# EAGLE design puissance_alim (EAGLE 6.6.0)
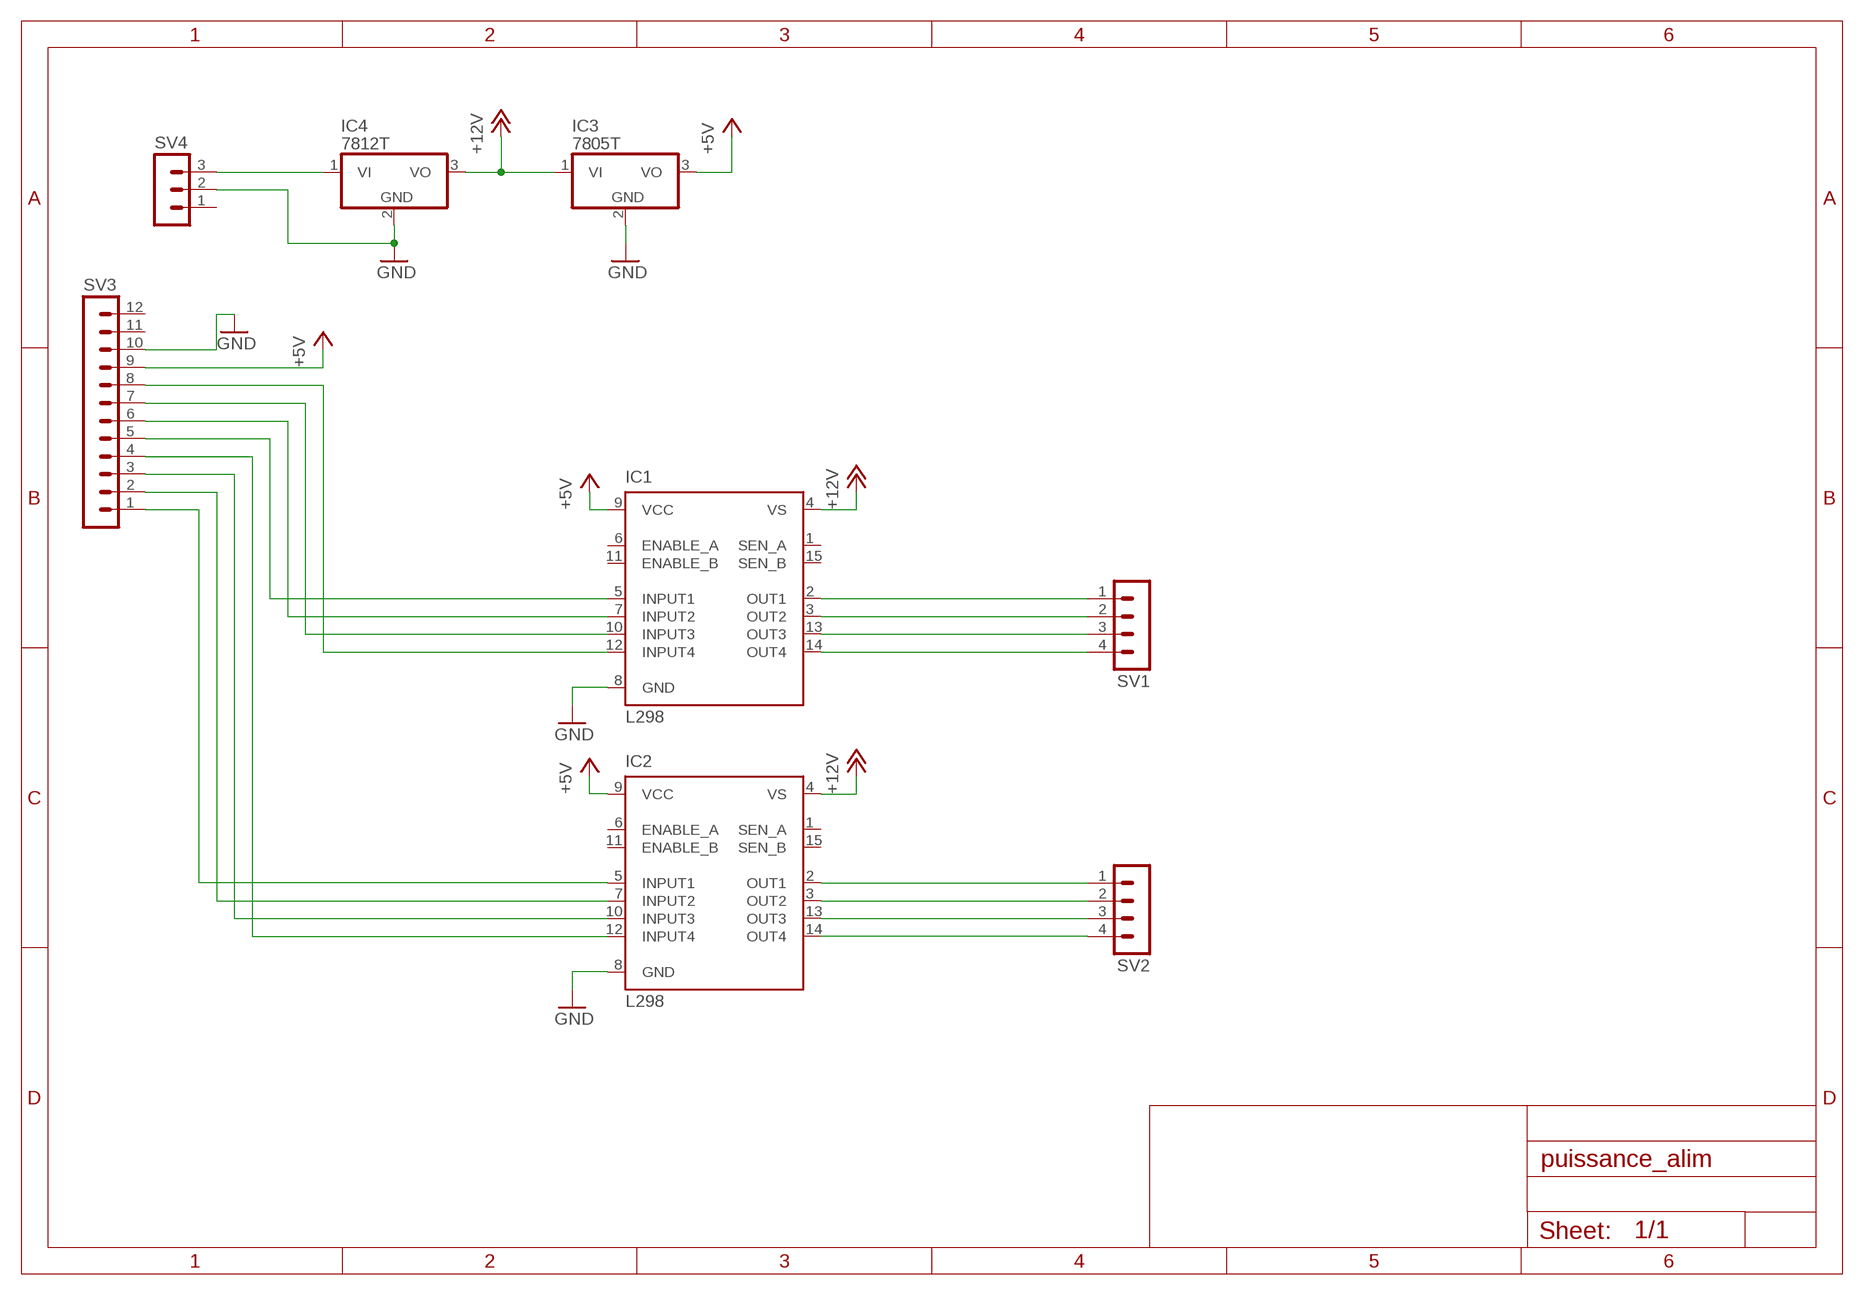
[diagram p0: schematic, sheet 1]

## Parts
IC1  L298  [MULTIWATT-15]
IC2  L298  [MULTIWATT-15]
IC3  7805T  [TO220H]
IC4  7812T  [TO220H]
SV1  MA04-1  [MA04-1]
SV2  MA04-1  [MA04-1]
SV3  MA12-1  [MA12-1]
SV4  MA03-1  [MA03-1]

## Nets
+5V: IC1.9(VCC) IC2.9(VCC) IC3.3(VO) SV3.9
+12V: IC1.4(VS) IC2.4(VS) IC3.1(VI) IC4.3(VO)
GND: IC1.8(GND) IC2.8(GND) IC3.2(GND) IC4.2(GND) SV3.10 SV4.2
N$1: IC2.5(INPUT1) SV3.1
N$2: IC2.7(INPUT2) SV3.2
N$3: IC2.10(INPUT3) SV3.3
N$4: IC2.12(INPUT4) SV3.4
N$5: IC1.5(INPUT1) SV3.5
N$6: IC1.7(INPUT2) SV3.6
N$7: IC1.10(INPUT3) SV3.7
N$8: IC1.12(INPUT4) SV3.8
N$9: IC1.2(OUT1) SV1.1
N$10: IC1.3(OUT2) SV1.2
N$11: IC1.13(OUT3) SV1.3
N$12: IC1.14(OUT4) SV1.4
N$13: IC2.2(OUT1) SV2.1
N$14: IC2.3(OUT2) SV2.2
N$15: IC2.13(OUT3) SV2.3
N$16: IC2.14(OUT4) SV2.4
N$18: IC4.1(VI) SV4.3
Unconnected: IC1.1(SEN_A) IC1.6(ENABLE_A) IC1.11(ENABLE_B) IC1.15(SEN_B) IC2.1(SEN_A) IC2.6(ENABLE_A) IC2.11(ENABLE_B) IC2.15(SEN_B) SV3.11 SV3.12 SV4.1

## Library data of the parts
IC1 IC2 = st-microelectronics:L298: DUAL FULL-BRIDGE DRIVER; MPN: L298N; OC_FARNELL: 1589425; OC_NEWARK: 32M1527
IC3 IC4 = linear:78*: Positive VOLTAGE REGULATOR Source: http://cache.national.com/ds/LM/LM78L05.pdf http://www.fairchildsemi.com/ds/LM/LM7805.pdf
SV1 SV2 = con-lstb:MA04-1: PIN HEADER; OC_FARNELL: unknown; OC_NEWARK: unknown
SV3 = con-lstb:MA12-1: PIN HEADER; OC_FARNELL: unknown; OC_NEWARK: unknown
SV4 = con-lstb:MA03-1: PIN HEADER; OC_FARNELL: unknown; OC_NEWARK: unknown

## Board
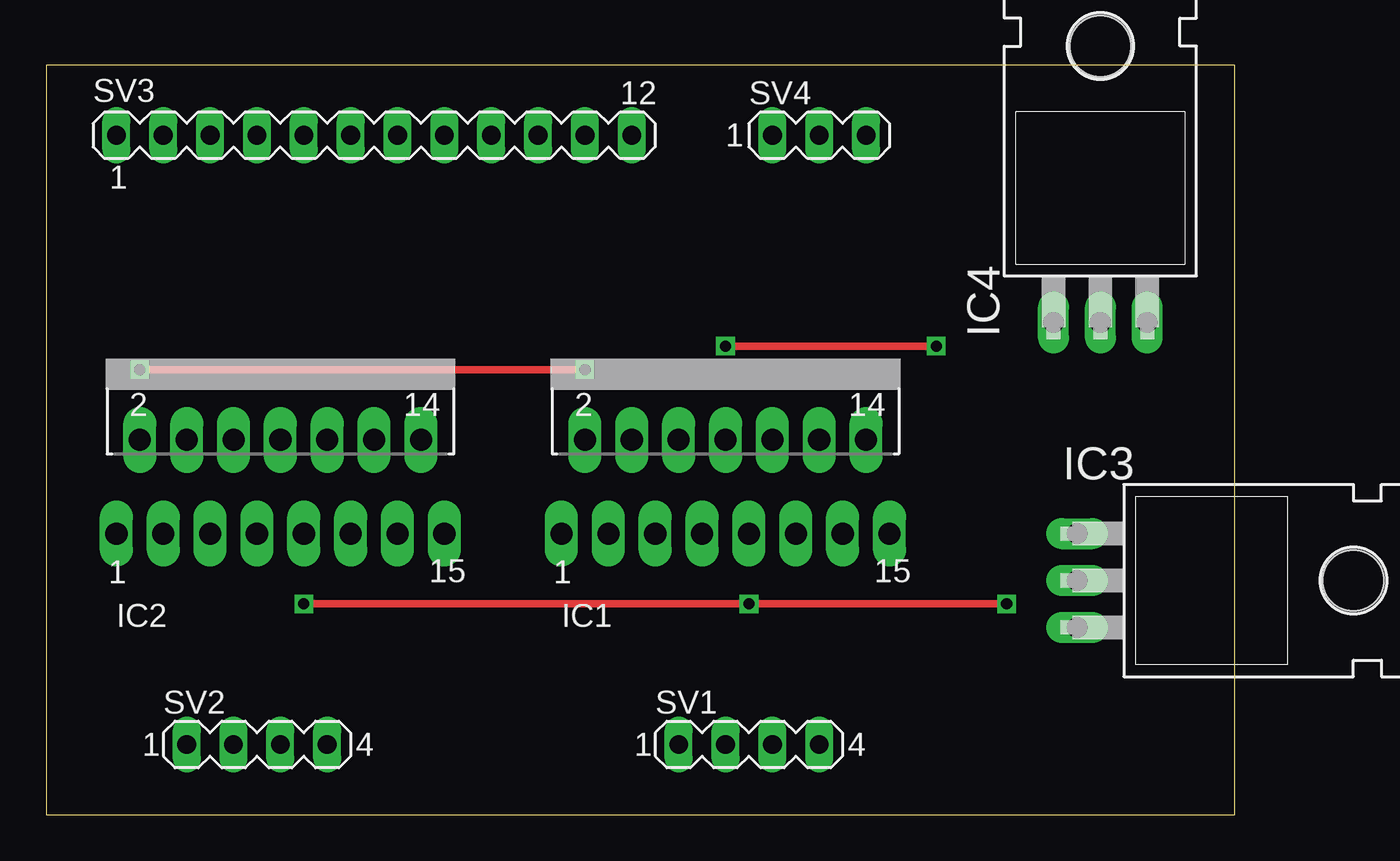
[diagram p1: board, top side]
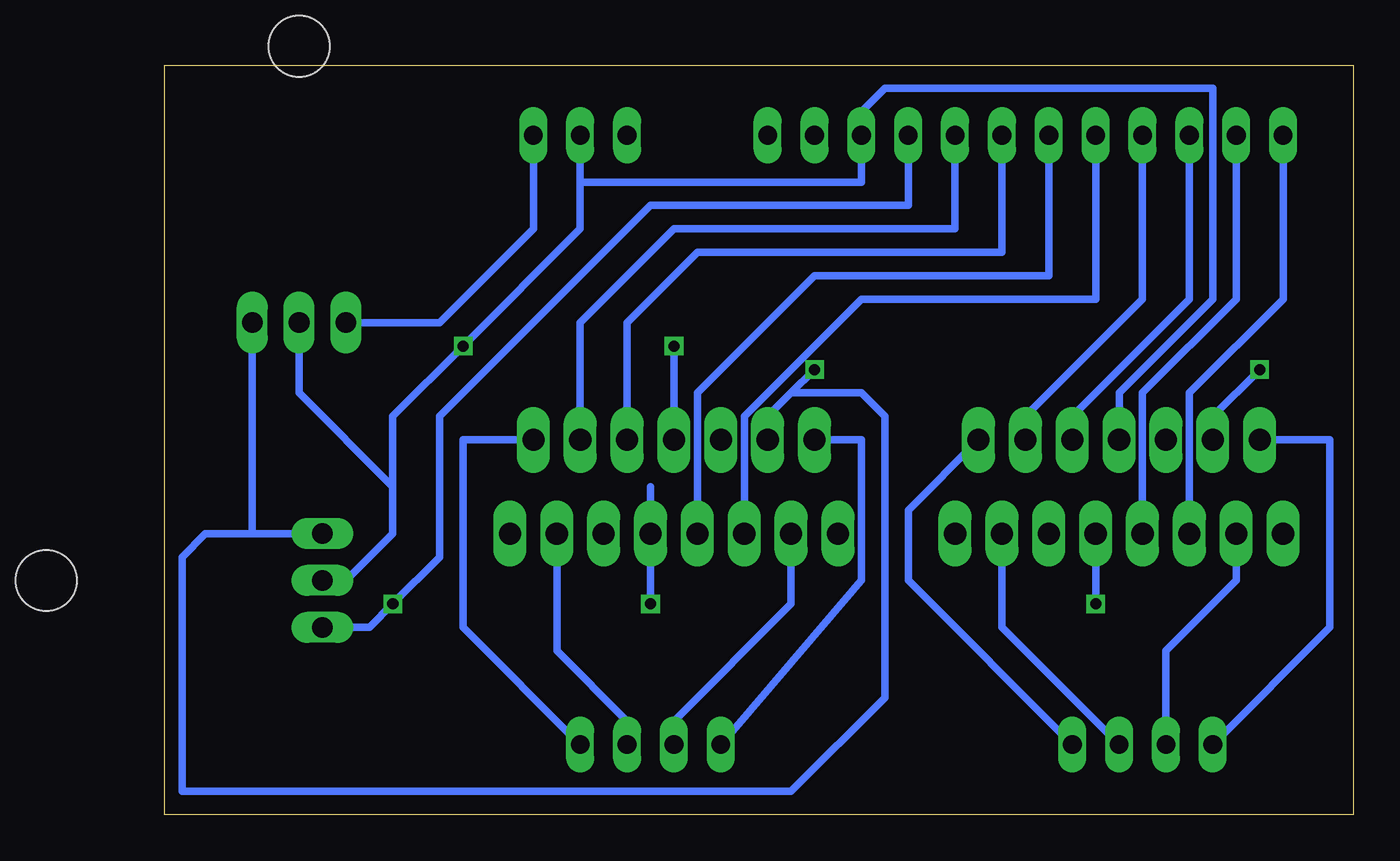
[diagram p2: board, bottom side, seen from below]

Size 64.44 x 40.63 mm. Coordinates in mm from the lower left corner, seen from the top.
Outline: 0,0 64.44,0 64.44,40.63 0,40.63 0,0
Copper layers (1*16): Top 0.035mm / dielectric 1.5mm / Bottom 0.035mm
Design rules "default": minimum track width 10mil, minimum drill 24mil, track to track 8mil, track to pad 8mil, pad to pad 8mil, via to via 8mil, smd to smd 8mil, copper to edge 40mil, drill to drill 8mil, minimum pad ring 10mil, minimum via ring 8mil, stop-mask expansion 4mil, vias tented up to drill 0mil, thermal gap 10mil

### Footprints (pad centres in the part's own frame; a part is rotated, then mirrored left to right if it is on the bottom)
MULTIWATT-15 = drill 1.2 long: 1 -8.89,-7.62; 2 -7.62,-2.54; 3 -6.35,-7.62; 4 -5.08,-2.54; 5 -3.81,-7.62; 6 -2.54,-2.54; 7 -1.27,-7.62; 8 0,-2.54; 9 1.27,-7.62; 10 2.54,-2.54; 11 3.81,-7.62; 12 5.08,-2.54; 13 6.35,-7.62; 14 7.62,-2.54; 15 8.89,-7.62
TO220H = drill 1.118 long: 1 -2.54,-10.16; 2 0,-10.16; 3 2.54,-10.16 | hole 3.302: 0,4.826
MA04-1 = drill 1.016 long: 1 -3.81,0; 2 -1.27,0; 3 1.27,0; 4 3.81,0
MA12-1 = drill 1.016 long: 1 -13.97,0; 2 -11.43,0; 3 -8.89,0; 4 -6.35,0; 5 -3.81,0; 6 -1.27,0; 7 1.27,0; 8 3.81,0; 9 6.35,0; 10 8.89,0; 11 11.43,0; 12 13.97,0
MA03-1 = drill 1.016 long: 1 -2.54,0; 2 0,0; 3 2.54,0

### Placement (x,y rotation side)
IC1  36.83,22.86 0 top
IC2  12.7,22.86 0 top
IC3  66.04,12.7 270 top
IC4  57.15,36.83 0 top
SV1  38.1,3.81 0 top
SV2  11.43,3.81 0 top
SV3  17.78,36.83 0 top
SV4  41.91,36.83 0 top

### Tracks (layer width: path | path; a pad name or v marks a point on that pad's centre or on a via)
+5V  (via drill 0.6)
  Top 0.406: v13.97,11.43 v38.1,11.43 v52.07,11.43
  Bottom 0.406: IC3.3 53.34,10.16 v52.07,11.43 49.53,13.97 49.53,21.59 38.1,33.02 24.13,33.02 SV3.9 | IC2.9 v13.97,11.43 | v38.1,11.43 IC1.9 38.1,17.78
+12V  (via drill 0.6)
  Top 0.406: v5.08,24.13 v29.21,24.13
  Bottom 0.406: IC2.4 7.62,21.59 v5.08,24.13 | v29.21,24.13 30.48,22.86 | 30.48,22.86 31.75,21.59 IC1.4 | IC3.1 59.69,15.24 | 59.69,15.24 62.23,15.24 63.5,13.97 63.5,1.27 30.48,1.27 25.4,6.35 25.4,21.59 26.67,22.86 30.48,22.86 | IC4.3 59.69,15.24
GND  (via drill 0.6)
  Top 0.406: v48.26,25.4 v36.83,25.4
  Bottom 0.406: IC2.8 12.7,22.86 7.62,27.94 7.62,39.37 25.4,39.37 26.67,38.1 SV3.10 26.67,34.29 41.91,34.29 | 41.91,34.29 SV4.2 | IC4.2 57.15,22.86 52.07,17.78 | 52.07,17.78 52.07,15.24 54.61,12.7 IC3.2 | 52.07,17.78 52.07,21.59 v48.26,25.4 41.91,31.75 41.91,34.29 | v36.83,25.4 IC1.8
N$1
  Bottom 0.406: IC2.5 8.89,22.86 3.81,27.94 SV3.1
N$2
  Bottom 0.406: SV3.2 6.35,27.94 11.43,22.86 IC2.7
N$3
  Bottom 0.406: SV3.3 8.89,27.94 15.24,21.59 IC2.10
N$4
  Bottom 0.406: IC2.12 17.78,21.59 11.43,27.94 SV3.4
N$5
  Bottom 0.406: IC1.5 33.02,21.59 26.67,27.94 13.97,27.94 SV3.5
N$6
  Bottom 0.406: SV3.6 16.51,29.21 29.21,29.21 35.56,22.86 IC1.7
N$7
  Bottom 0.406: SV3.7 19.05,30.48 35.56,30.48 39.37,26.67 IC1.10
N$8
  Bottom 0.406: SV3.8 21.59,31.75 36.83,31.75 41.91,26.67 IC1.12
N$9
  Bottom 0.406: IC1.2 26.67,20.32 26.67,12.7 SV1.1
N$10
  Bottom 0.406: IC1.3 30.48,11.43 36.83,5.08 SV1.2
N$11
  Bottom 0.406: IC1.13 43.18,8.89 39.37,5.08 SV1.3
N$12
  Bottom 0.406: IC1.14 48.26,20.32 48.26,10.16 SV1.4
N$13
  Bottom 0.406: IC2.2 1.27,20.32 1.27,10.16 SV2.1
N$14
  Bottom 0.406: IC2.3 6.35,12.7 10.16,8.89 SV2.2
N$15
  Bottom 0.406: IC2.13 19.05,10.16 SV2.3
N$16
  Bottom 0.406: SV2.4 24.13,12.7 24.13,16.51 IC2.14
N$18
  Bottom 0.406: SV4.3 44.45,31.75 49.53,26.67 IC4.1